# Altium schematic sheet rtc.SchDoc
size A4
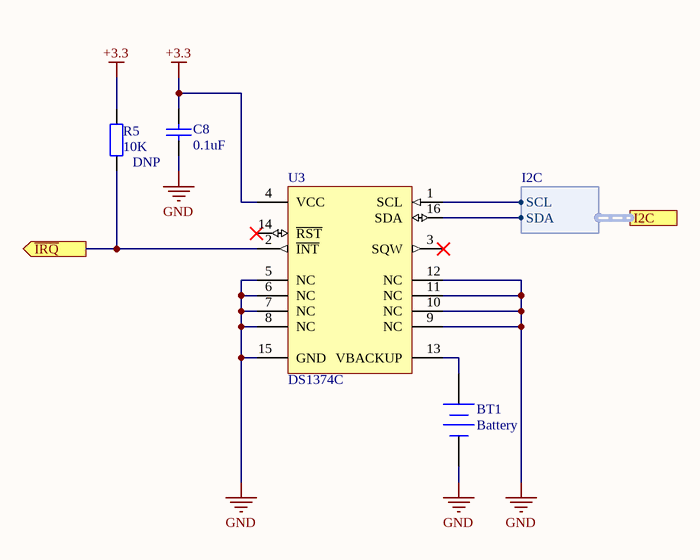
[diagram p0: rtc.SchDoc]

## Parts
BT1  Battery  [3002]
C8  value 0.1uF  [C0603]  (hidden comment: Cap)
R5  value 10K  Place: DNP  [R0603]  (hidden comment: Res)
U3  DS1374C  [DS1374C]

## Ports
I2C (harness I2C), ~{IRQ} (out)

## Harnesses
I2C: SCL, SDA

## Nets
+3.3: C8.1 R5.1 U3.4(VCC)
GND: BT1.2(-) C8.2 U3.5(NC) U3.6(NC) U3.7(NC) U3.8(NC) U3.9(NC) U3.10(NC) U3.11(NC) U3.12(NC) U3.15(GND)
~{IRQ}: R5.2 U3.2(~{INT}) ; port ~{IRQ}
NetBT1_1: BT1.1(+) U3.13(VBACKUP)
NetU3_1: U3.1(SCL) ; port I2C.SCL
NetU3_16: U3.16(SDA) ; port I2C.SDA

Not connected (* = marked no-connect by the designer): U3 3(SQW)* 14(~{RST})*

## Library data of the parts
BT1 = Battery: Multicell Battery; Published: 24-Mar-1999; LatestRevisionDate: 17-Jul-2002; LatestRevisionNote: Re-released for DXP Platform.; PackageReference: BAT-2; Publisher: Altium Limited; farnell: 1650693
C8 = Cap: Capacitor; farnell: 1759122
R5 = Res2: Resistor
U3 = DS1374C: DS1374 I2C, 32-Bit Binary Counter Watchdog RTC with Trickle Charger and Reset Input/Output; rs: 732-7380